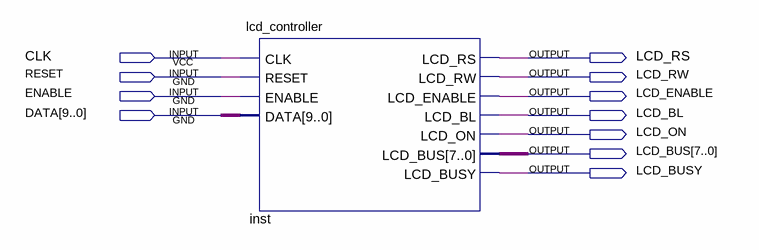
[diagram p0: schematic sheet]
// Quartus schematic lcd_test.bdf as structural Verilog: 1 symbols, 11 pins
module lcd_test (
  input  CLK,
  input  RESET,
  input  ENABLE,
  input  [9:0] DATA,
  output LCD_RS,
  output LCD_RW,
  output LCD_ENABLE,
  output LCD_BL,
  output LCD_ON,
  output [7:0] LCD_BUS,
  output LCD_BUSY
);

  lcd_controller inst (
    .CLK(CLK), .RESET(RESET), .ENABLE(ENABLE), .DATA(DATA), .LCD_RS(LCD_RS), .LCD_RW(LCD_RW),
    .LCD_ENABLE(LCD_ENABLE), .LCD_BL(LCD_BL), .LCD_ON(LCD_ON), .LCD_BUS(LCD_BUS), .LCD_BUSY(LCD_BUSY));
endmodule
